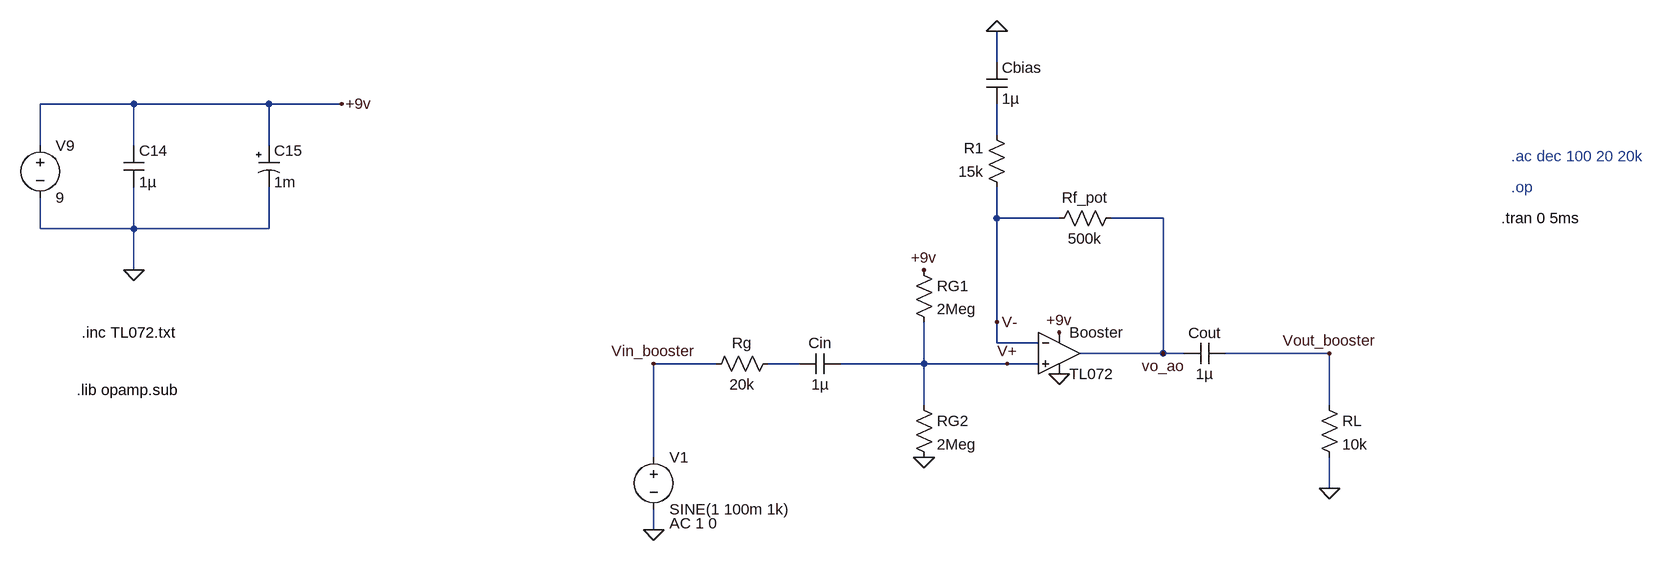
[diagram p0: schematic booster.asc]
booster.asc, the LTspice schematic file:
Version 4
SHEET 1 3812 3056
WIRE -96 720 -96 672
WIRE -1424 784 -1568 784
WIRE -1216 784 -1424 784
WIRE -1104 784 -1216 784
WIRE -96 832 -96 784
WIRE -1568 848 -1568 784
WIRE -1424 848 -1424 784
WIRE -1216 848 -1216 784
WIRE -96 960 -96 912
WIRE 0 960 -96 960
WIRE 160 960 80 960
WIRE -1568 976 -1568 928
WIRE -1424 976 -1424 912
WIRE -1424 976 -1568 976
WIRE -1216 976 -1216 912
WIRE -1216 976 -1424 976
WIRE -1424 1040 -1424 976
WIRE -96 1120 -96 960
WIRE -96 1152 -96 1120
WIRE -32 1152 -96 1152
WIRE 160 1168 160 960
WIRE 160 1168 32 1168
WIRE 192 1168 160 1168
WIRE 416 1168 256 1168
WIRE -528 1184 -624 1184
WIRE -400 1184 -448 1184
WIRE -208 1184 -208 1120
WIRE -208 1184 -336 1184
WIRE -80 1184 -208 1184
WIRE -32 1184 -80 1184
WIRE -208 1248 -208 1184
WIRE 416 1248 416 1168
WIRE -624 1328 -624 1184
WIRE 416 1376 416 1328
WIRE -624 1440 -624 1408
FLAG -624 1440 0
FLAG -1424 1040 0
FLAG -1104 784 +9v
FLAG 0 1136 +9v
FLAG -624 1184 Vin_booster
FLAG 416 1168 Vout_booster
FLAG 0 1200 0
FLAG -208 1040 +9v
FLAG -208 1328 0
FLAG -96 672 0
FLAG -80 1184 V+
FLAG -96 1120 V-
FLAG 416 1376 0
FLAG 160 1168 vo_ao
SYMBOL Res -80 928 R180
WINDOW 0 36 76 Left 2
WINDOW 3 36 40 Left 2
SYMATTR InstName R1
SYMATTR Value 15k
SYMBOL Res 96 944 R90
WINDOW 0 0 56 VBottom 2
WINDOW 3 32 56 VTop 2
SYMATTR InstName Rf_pot
SYMATTR Value 500k
SYMBOL voltage -624 1312 R0
WINDOW 123 24 118 Left 2
SYMATTR Value2 AC 1 0
SYMATTR InstName V1
SYMATTR Value SINE(1 100m 1k)
SYMBOL voltage -1568 832 R0
SYMATTR InstName V9
SYMATTR Value 9
SYMBOL Cap -1440 848 R0
SYMATTR InstName C14
SYMATTR Value 1µ
SYMBOL polcap -1232 848 R0
WINDOW 3 24 56 Left 2
SYMATTR Value 1m
SYMATTR InstName C15
SYMATTR Description Capacitor
SYMATTR Type cap
SYMATTR SpiceLine Rser=0 Lser=0 mfg="   ---" pn="   ---" type="   ---"
SYMBOL OpAmps/opamp2 0 1104 R0
SYMATTR InstName Booster
SYMATTR Value TL072
SYMBOL Cap 256 1152 R90
WINDOW 0 0 32 VBottom 2
WINDOW 3 32 32 VTop 2
SYMATTR InstName Cout
SYMATTR Value 1µ
SYMBOL Res -224 1024 R0
SYMATTR InstName RG1
SYMATTR Value 2Meg
SYMBOL Res -224 1232 R0
SYMATTR InstName RG2
SYMATTR Value 2Meg
SYMBOL Cap -336 1168 R90
WINDOW 0 0 32 VBottom 2
WINDOW 3 32 32 VTop 2
SYMATTR InstName Cin
SYMATTR Value 1µ
SYMBOL Cap -112 720 R0
SYMATTR InstName Cbias
SYMATTR Value 1µ
SYMBOL Res -432 1168 R90
WINDOW 0 0 56 VBottom 2
WINDOW 3 32 56 VTop 2
SYMATTR InstName Rg
SYMATTR Value 20k
SYMBOL Res 400 1232 R0
SYMATTR InstName RL
SYMATTR Value 10k
TEXT 680 960 Left 2 !.tran 0 5ms
TEXT -1512 1224 Left 2 !.lib opamp.sub
TEXT -1504 1136 Left 2 !.inc TL072.txt
TEXT 696 864 Left 2 ;.ac dec 100 20 20k
TEXT 696 912 Left 2 ;.op

The netlist it stands for:
* booster.asc
R1 V- N001 15k
Rf_pot vo_ao V- 500k
V1 Vin_booster 0 SINE(1 100m 1k) AC 1 0
V9 +9v 0 9
C14 +9v 0 1µ
C15 +9v 0 1m Rser=0 Lser=0 mfg="   ---" pn="   ---" type="   ---"
XBooster V+ V- +9v 0 vo_ao TL072  ; pins In+ In- V+ V- OUT
Cout Vout_booster vo_ao 1µ
RG1 +9v V+ 2Meg
RG2 V+ 0 2Meg
Cin V+ N002 1µ
Cbias 0 N001 1µ
Rg N002 Vin_booster 20k
RL Vout_booster 0 10k
.tran 0 5ms
.lib opamp.sub
.inc TL072.txt
* .ac dec 100 20 20k
* .op
.backanno
.end